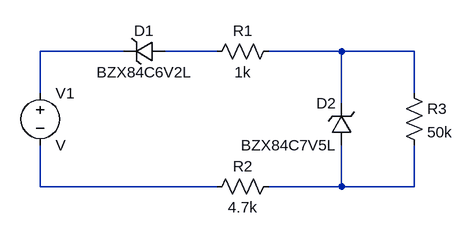
[diagram p0: schematic Experiment 3.asc]
Experiment 3.asc, the LTspice schematic file:
Version 4
SHEET 1 880 680
WIRE -112 16 -240 16
WIRE 32 16 -48 16
WIRE 224 16 112 16
WIRE 336 16 224 16
WIRE -240 80 -240 16
WIRE 336 80 336 16
WIRE 224 96 224 16
WIRE -240 224 -240 160
WIRE 32 224 -240 224
WIRE 224 224 224 160
WIRE 224 224 112 224
WIRE 336 224 336 160
WIRE 336 224 224 224
SYMBOL voltage -240 64 R0
SYMATTR InstName V1
SYMBOL zener -48 0 R90
WINDOW 0 0 32 VBottom 2
WINDOW 3 32 32 VTop 2
SYMATTR InstName D1
SYMATTR Value BZX84C6V2L
SYMATTR Description Diode
SYMATTR Type diode
SYMBOL res 16 32 R270
WINDOW 0 32 56 VTop 2
WINDOW 3 0 56 VBottom 2
SYMATTR InstName R1
SYMATTR Value 1k
SYMBOL zener 240 160 R180
WINDOW 0 24 64 Left 2
WINDOW 3 24 0 Left 2
SYMATTR InstName D2
SYMATTR Value BZX84C7V5L
SYMATTR Description Diode
SYMATTR Type diode
SYMBOL res 128 208 R90
WINDOW 0 0 56 VBottom 2
WINDOW 3 32 56 VTop 2
SYMATTR InstName R2
SYMATTR Value 4.7k
SYMBOL res 320 64 R0
SYMATTR InstName R3
SYMATTR Value 50k

The netlist it stands for:
* Experiment 3.asc
V1 N001 N004 V
D1 N002 N001 BZX84C6V2L
R1 N002 N003 1k
D2 N005 N003 BZX84C7V5L
R2 N005 N004 4.7k
R3 N003 N005 50k
.model D D
.lib standard.dio
.backanno
.end